# EasyEDA schematic SCH_MCP3008-Raspberry-Pi-3B+-SPI_2025-04-22.json
TITLE: Raspberry Pi 3B+ and MCP3080 Combo; REV: 1.0; Date: 2025-04-22; Sheet: 1/1; Drawn By: Mikayel Grigoryan; Company: TUMO Labs
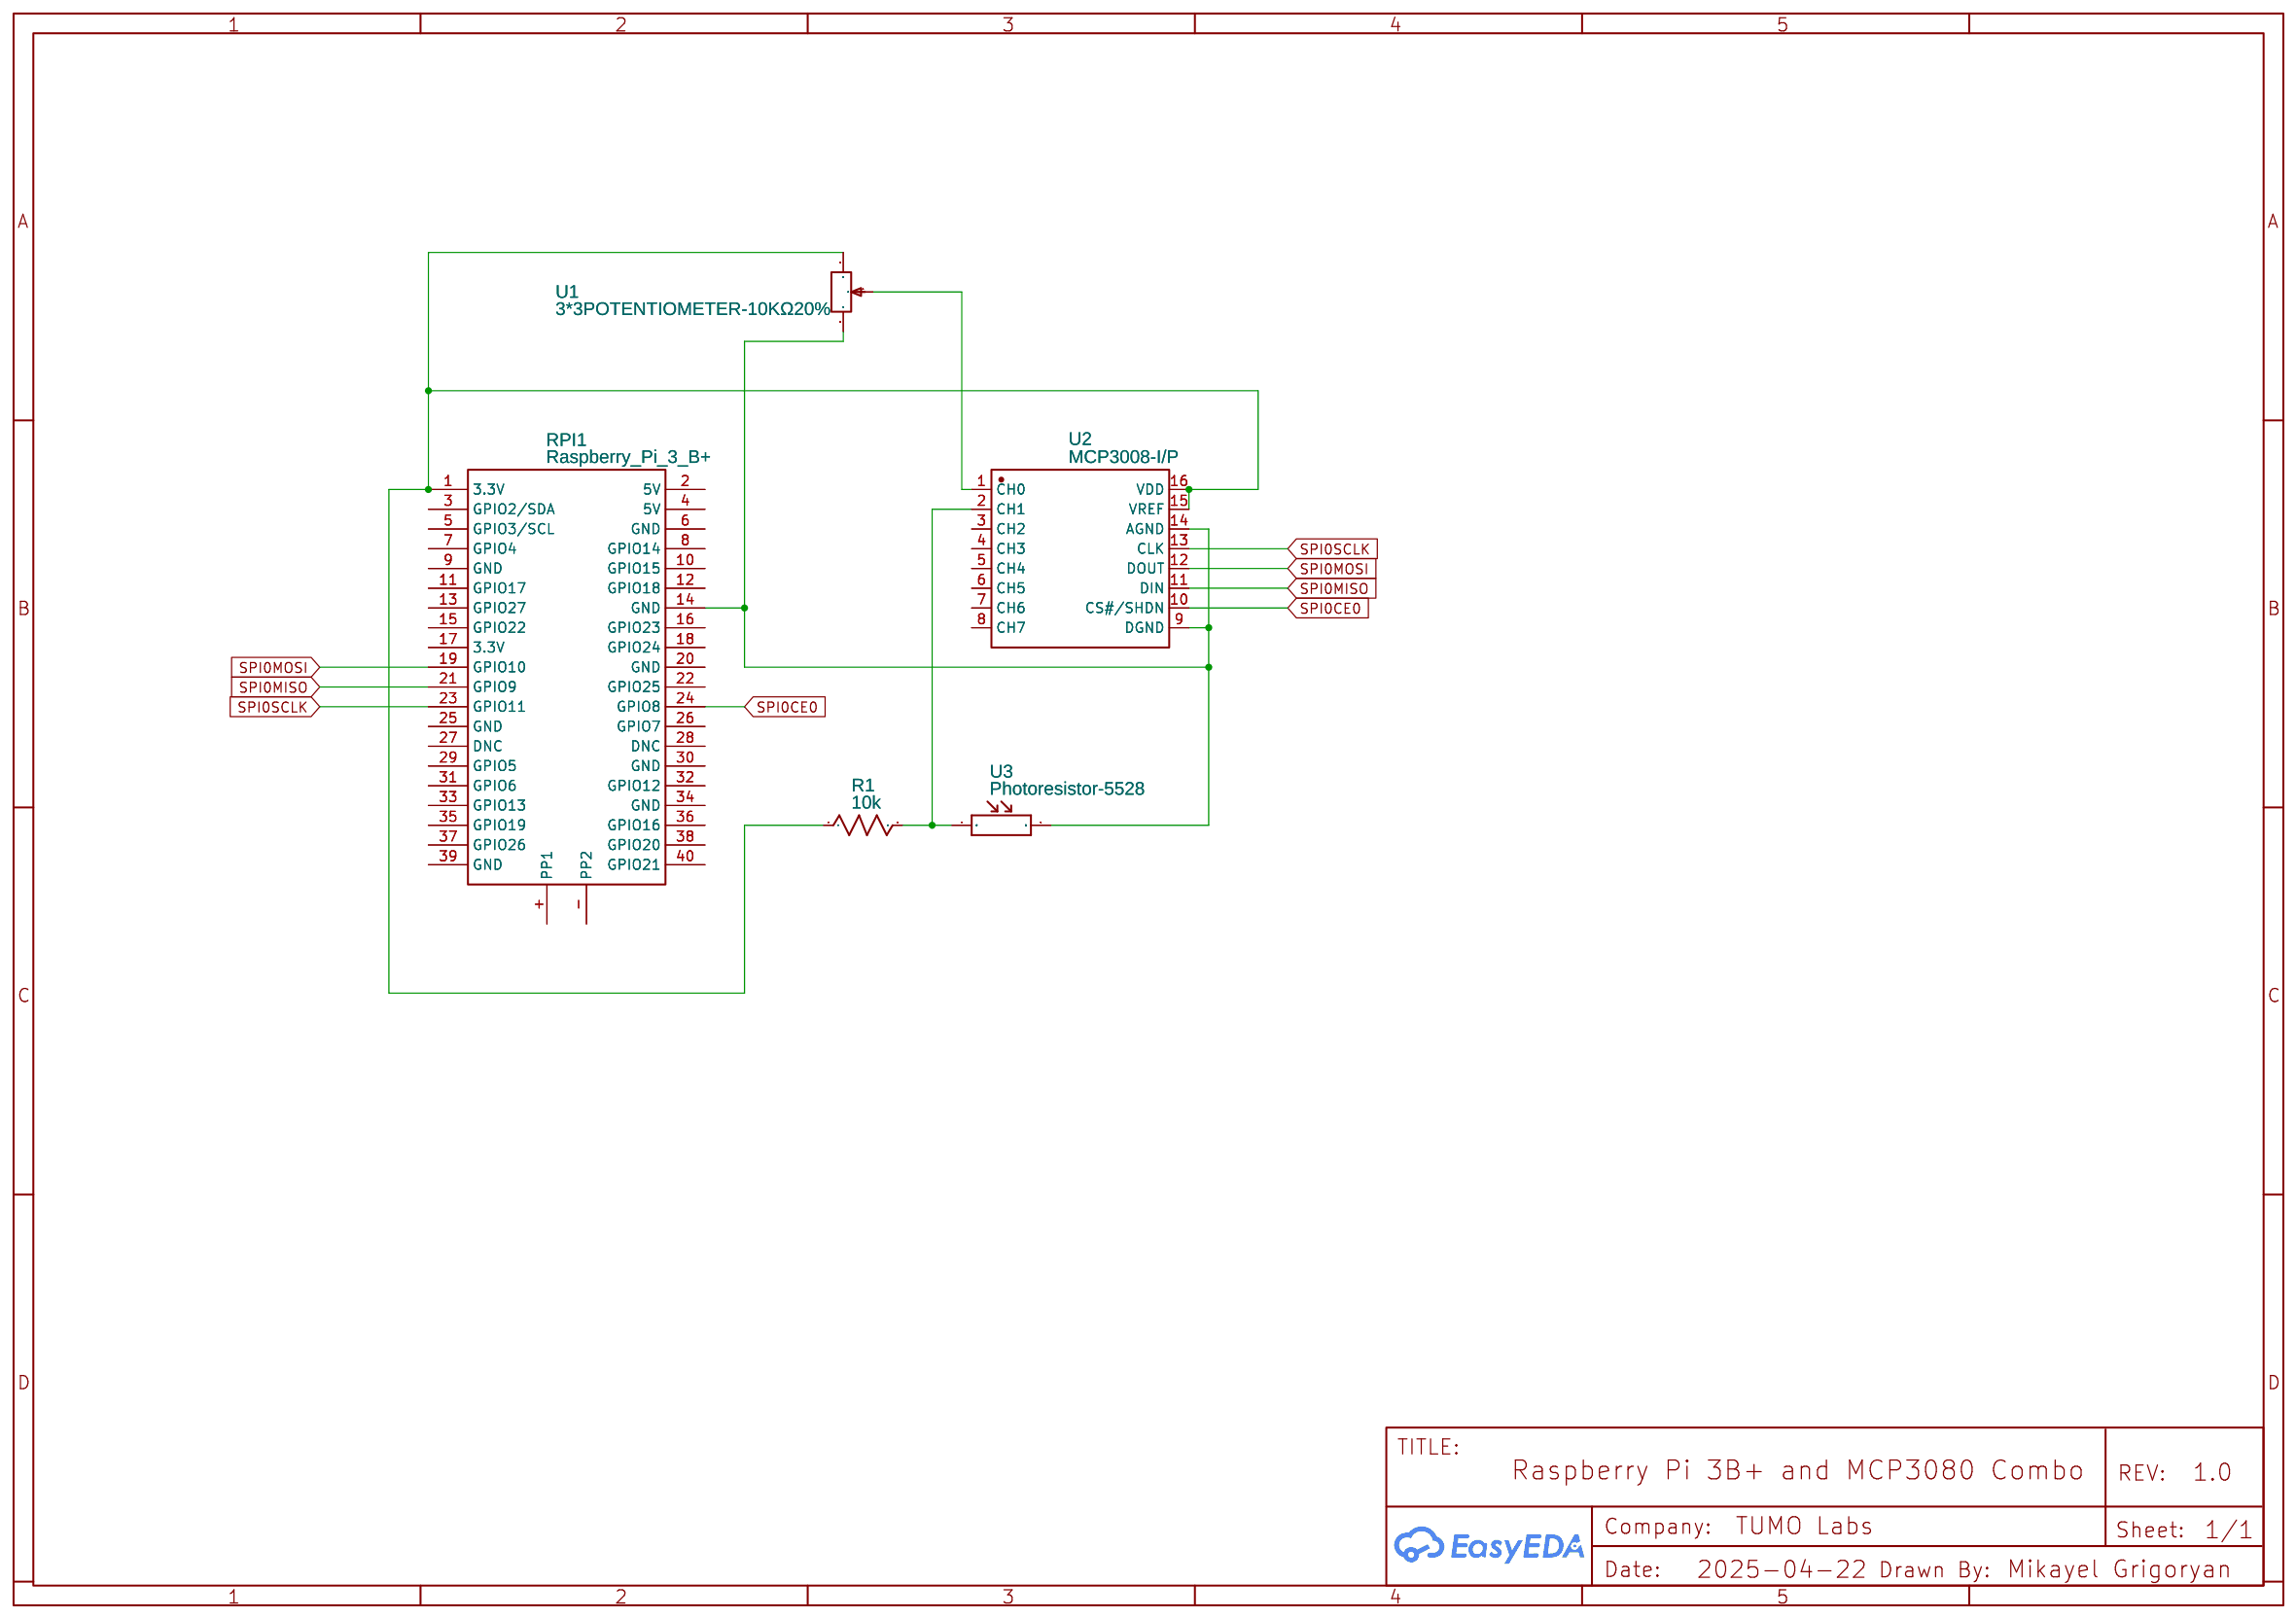
[diagram p0: schematic sheet]

## Parts
R1  10k  [R0603]
RPI1  Raspberry_Pi_3_B+  [HDR-20X2/2.54]
U1  3*3POTENTIOMETER-10KΩ20%  [RES-ADJ-SMD_VG039NCH]
U2  MCP3008-I/P  [PDIP-16_L19.3-W6.5-P2.54-LS7.6-BL]
U3  Photoresistor-5528  [SNR2-3.0]

## Library data of the parts
R1 = R_0603_US: Contributor: LCEDA_Lib
RPI1 = Raspberry_Pi_3_B+: Contributor: Christopher; Supplier: Adafruit; Manufacturer: Raspberry Pi; Supplier Part: 3775; Manufacturer Part: Raspberry Pi 3 - Model B+ - 1.4GHz Cortex-A53 with 1GB RAM
U1 = 3*3POTENTIOMETER-10KΩ20%: Contributor: LCSC; Supplier: LCSC; Supplier Part: C9900010776; Manufacturer: null; Manufacturer Part: 3*3Potentiometer-10kΩ20%; JLCPCB Part Class: Extended Part
U2 = MCP3008-I/P: Contributor: LCSC; Supplier: LCSC; Supplier Part: C2890491; Manufacturer: MICROCHIP(美国微芯); JLCPCB Part Class: Extended Part
U3 = Photoresistor-5528: DIP RES Photoresistor 10K;2P-3.0

## Nets
SPI0CE0: RPI1.24(GPIO8) U2.10(CS#/SHDN)
SPI0MISO: RPI1.21(GPIO9) U2.11(DIN)
SPI0MOSI: RPI1.19(GPIO10) U2.12(DOUT)
SPI0SCLK: RPI1.23(GPIO11) U2.13(CLK)
Net-(R1-1): R1.1 RPI1.1(3.3V) U1.1 U2.15(VREF) U2.16(VDD)
Net-(R1-2): R1.2 U2.2(CH1) U3.1(P$1)
Net-(RPI1-14): RPI1.14(GND) U1.3 U2.9(DGND) U2.14(AGND) U3.2(P$2)
Net-(U1-2): U1.2 U2.1(CH0)

Not connected (* = marked no-connect by the designer): RPI1 2(5V) 3(GPIO2/SDA) 4(5V) 5(GPIO3/SCL) 6(GND) 7(GPIO4) 8(GPIO14) 9(GND) 10(GPIO15) 11(GPIO17) 12(GPIO18) 13(GPIO27) 15(GPIO22) 16(GPIO23) 17(3.3V) 18(GPIO24) 20(GND) 22(GPIO25) 25(GND) 26(GPIO7) 27(DNC) 28(DNC) 29(GPIO5) 30(GND) 31(GPIO6) 32(GPIO12) 33(GPIO13) 34(GND) 35(GPIO19) 36(GPIO16) 37(GPIO26) 38(GPIO20) 39(GND) 40(GPIO21) +(PP1) -(PP2); U2 3(CH2) 4(CH3) 5(CH4) 6(CH5) 7(CH6) 8(CH7)
